# EAGLE design Zeus (EAGLE 9.6.2)
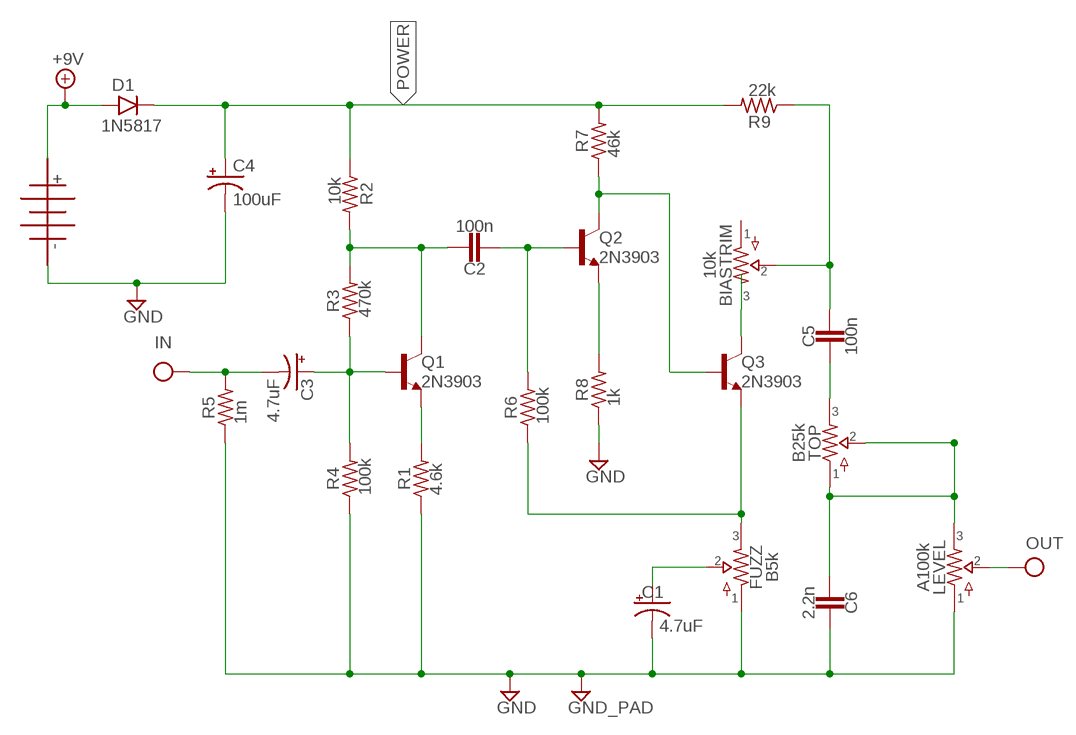
[diagram p0: schematic, sheet 1]

## Parts
9V  BATTERYBAT2  [BATTERY2]
BIASTRIM  10k  TRIMMER  [TRIM1]
C1  4.7uF  0501  [050_020_1]
C2  100n  CAP.2  [0.2".SML]
C3  4.7uF  0501  [050_020_1]
C4  100uF  0631  [063_025]
C5  100n  CAP.2  [0.2".SML]
C6  2.2n  CAP.2  [0.2".SML]
D1  1N5817  DO41.3  [DO41-3]
FUZZ  B5k  16MM.1  [16MM_B.MOUNT]
GND  GND_PAD  [SQUARE]
IN  IN  [SQUARE]
LEVEL  A100k  16MM.1  [16MM_B.MOUNT]
OUT  OUT  [SQUARE]
Q1  2N3903  2N5088  [TO92]
Q2  2N3903  2N5088  [TO92]
Q3  2N3903  2N5088  [TO92]
R1  4.6k  RESISTORS.3B  [R0207/3]
R2  10k  RESISTORS.3B  [R0207/3]
R3  470k  RESISTORS.3B  [R0207/3]
R4  100k  RESISTORS.3B  [R0207/3]
R5  1m  RESISTORS.3B  [R0207/3]
R6  100k  RESISTORS.3B  [R0207/3]
R7  46k  RESISTORS.3B  [R0207/3]
R8  1k  RESISTORS.3B  [R0207/3]
R9  22k  RESISTORS.3B  [R0207/3]
TOP  B25k  16MM.1  [16MM_B.MOUNT]

## Nets
+9V: 9V.P$1 D1.A
GND: 9V.P$2 C1.- C4.- C6.1 FUZZ.1 GND.1(GND) LEVEL.1 R1.1 R4.1 R5.1 R8.1
IN: C3.- IN.1(IN) R5.2
N$1: C2.1 Q1.1(C) R2.2 R3.2
N$2: C2.2 Q2.2(B) R6.2
N$3: C3.+ Q1.2(B) R3.1 R4.2
N$4: C5.2 TOP.3
N$5: Q1.3(E) R1.2
N$6: Q2.3(E) R8.2
N$7: FUZZ.3 Q3.3(E) R6.1
N$8: C1.+ FUZZ.2
N$10: BIASTRIM.3 Q3.1(C)
N$12: Q2.1(C) Q3.2(B) R7.1
N$13: BIASTRIM.2 C5.1 R9.1
N$14: C6.2 LEVEL.3 TOP.1 TOP.2
OUT: LEVEL.2 OUT.1(OUT)
POWER: C4.+ D1.C R2.1 R7.2 R9.2
Unconnected: BIASTRIM.1

## Library data of the parts
9V = jacks:BATTERY
BIASTRIM = potentiometers:TRIMMER: Trimpots
C1 C3 = caps-elec:050: 0.22 - 100uF Xicon values at Mouser.com: 10V: 10 - 100uF; 16V: 2.2 - 47uF; 25V: 0.47 - 47uF; 50V: 0.22 - 22uF
C2 C5 C6 = caps-film:CAP: For Ceramic, Film, MLCC caps
C4 = caps-elec:063: 33 - 220uF Xicon values at Mouser.com 10V: 220uF; 16V: 100uF; 25V: 100uF; 50V: 33uF
D1 = diodes:DO41: DO-41 Package Diodes: 1N4001 - 1N40019 Zener Diodes: 1N4728 - 1N4764
FUZZ LEVEL TOP = potentiometers:16MM: 16mm Poteniometers
GND = supply pins:GND_PAD: Ground use this to hook up ground connections throughout a schematic instead of running wire automatically labels the net "GND"
IN = supply pins:IN: Input obsolete: use Mark instead and label net schematic input label without circuit board terminal/pad labels net "IN" provided as complement to OUT (rarely used)
OUT = supply pins:OUT: Output obsolete: use Mark instead and label net output label without circuit board terminal/pad commonly used as output label on 2nd lug of a potentiometer
Q1-Q3 = transistors-BJT:2N5088: NPN - 2n5088, 2n5089, 2n3904, MPSA18 [C]-B-E pinout 2n5088: http://smallbear-electronics.mybigcommerce.com/transistor-2n5088/ 2n5089: http://smallbear-electronics.mybigcommerce.com/transistor-2n5089/ 2n5089: http://smallbear-electronics.mybigcommerce.com/transistor-2n5089-motorola/ 2n3904: http://smallbear-electronics.mybigcommerce.com/transistor-2n3904/ MPSA18: http://smallbear-electronics.mybigcommerce.com/transistor-mpsa18/
R1-R9 = resistors:RESISTORS

## Board
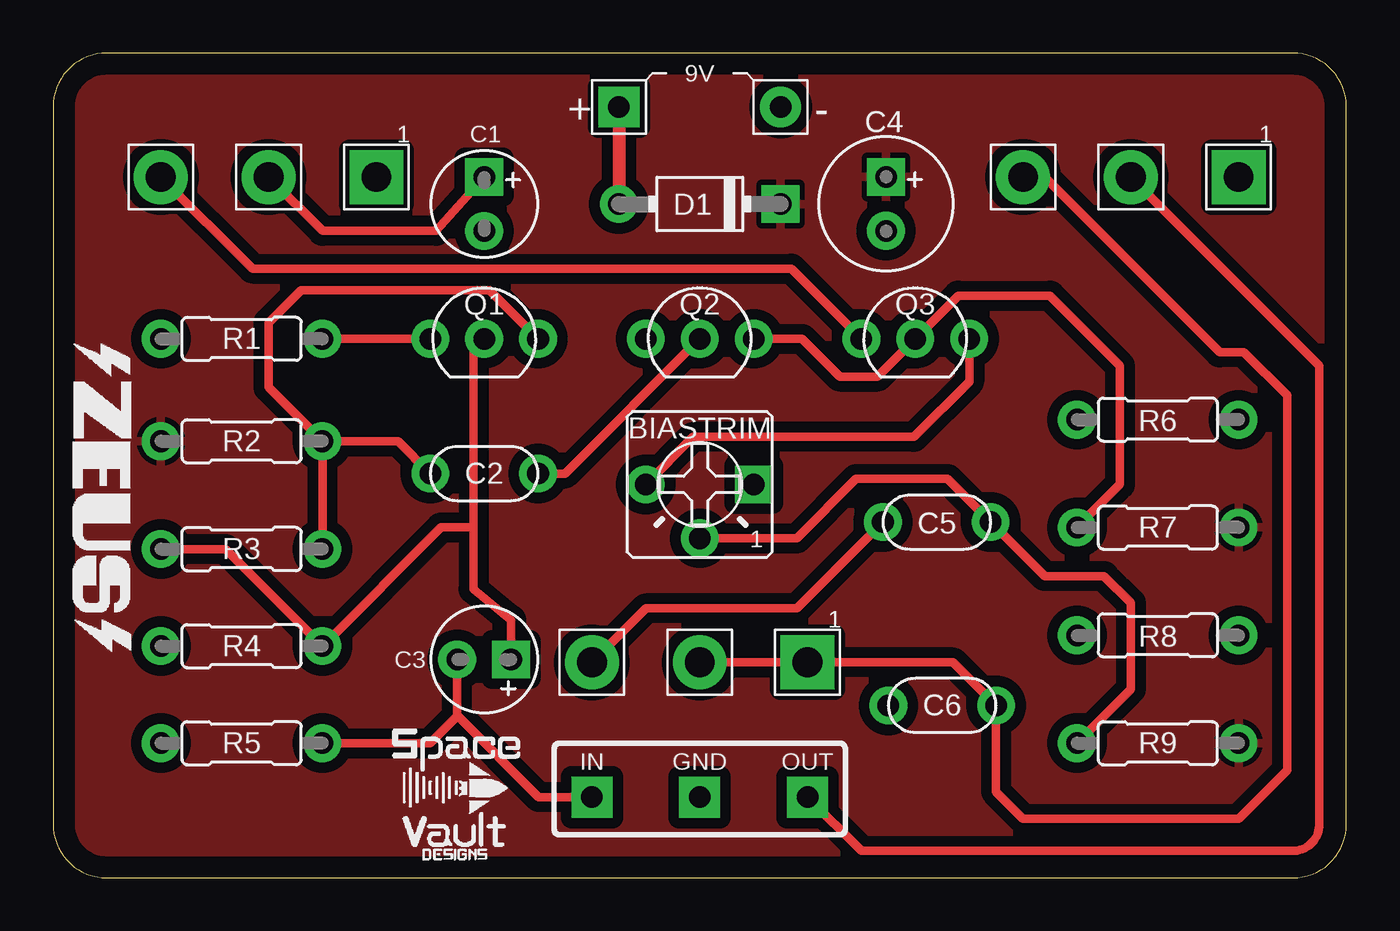
[diagram p1: board, top side]
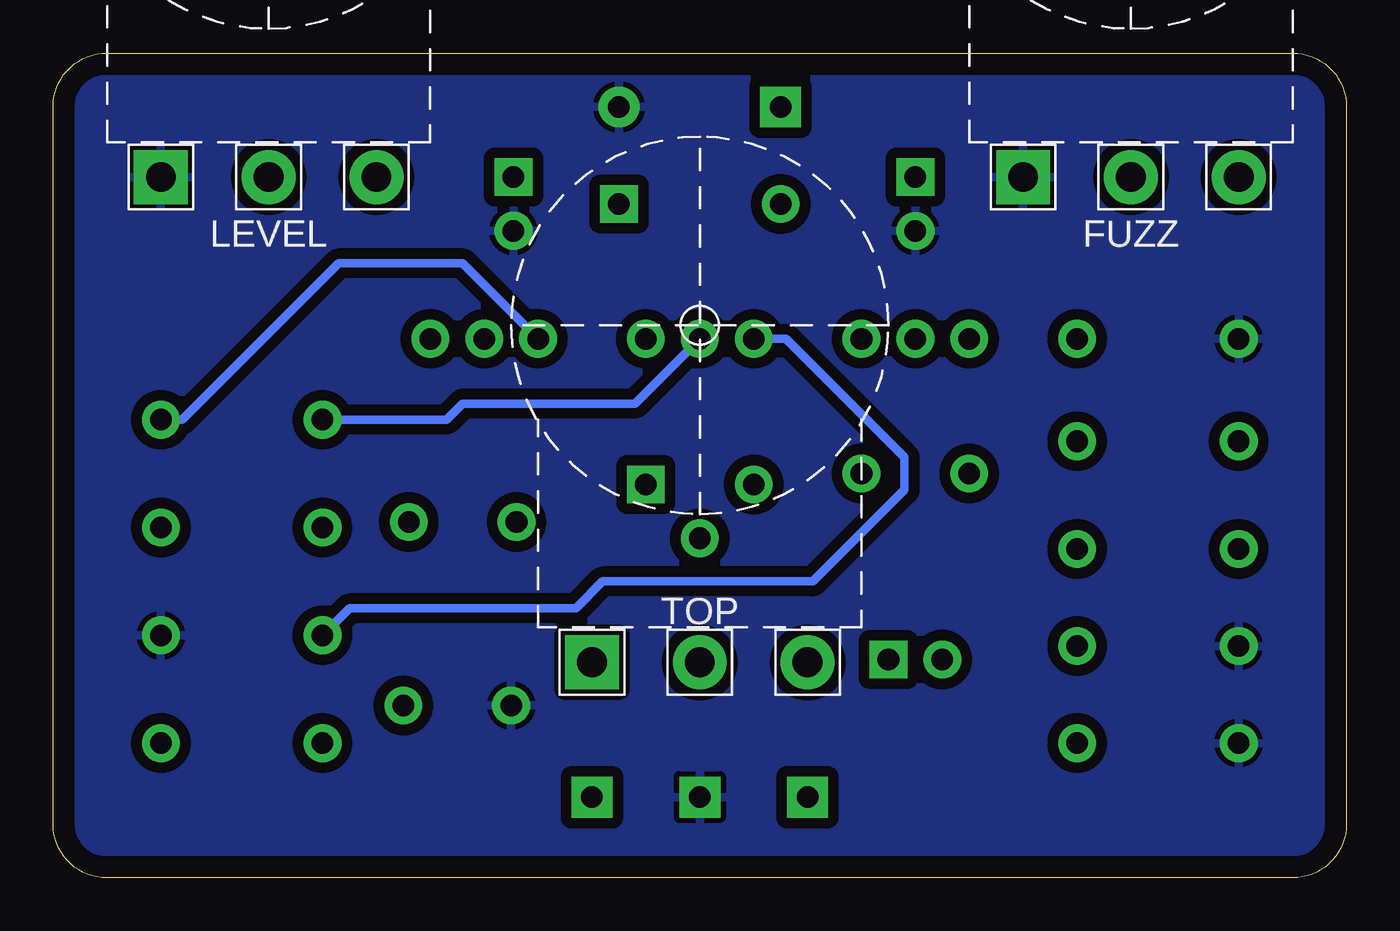
[diagram p2: board, bottom side, seen from below]

Size 60.96 x 38.86 mm. Coordinates in mm from the lower left corner, seen from the top.
Outline: 0,2.54 arc90 2.54,0 58.42,0 arc90 60.96,2.54 60.96,36.32 arc90 58.42,38.86 2.54,38.86 arc90 0,36.32 0,2.54
Copper layers (1*16): Top 0.035mm / dielectric 1.5mm / Bottom 0.035mm
Design rules "default": minimum track width 6mil, minimum drill 0.35mm, track to track 6mil, track to pad 6mil, pad to pad 6mil, via to via 6mil, smd to smd 6mil, copper to edge 40mil, drill to drill 6mil, minimum pad ring 10mil, minimum via ring 8mil, stop-mask expansion 4mil, vias tented up to drill 0mil, thermal gap 10mil

### Footprints (pad centres in the part's own frame; a part is rotated, then mirrored left to right if it is on the bottom)
BATTERY2 = drill 1.016 pad 1.93 square: P$1 -3.81,0 | drill 1.016 pad 1.93: P$2 3.81,0
TRIM1 = drill 1.016 pad 1.778 square: 1 -2.54,0 | drill 1.016 pad 1.778: 2 0,2.54; 3 2.54,0
050_020_1 = drill 1.016 pad 1.778 square: + -1.27,0 | drill 1.016 pad 1.778: - 1.27,0
0.2".SML = drill 1.016 pad 1.778: 1 -2.54,0; 2 2.54,0
063_025 = drill 1.016 pad 1.778 square: + -1.27,0 | drill 1.016 pad 1.778: - 1.27,0
DO41-3 = drill 1.016 pad 1.778: A 3.81,0 | drill 1.016 pad 1.778 square: C -3.81,0
16MM_B.MOUNT = drill 1.4 pad 2.54 square: 1 5.08,0 | drill 1.4 pad 2.54: 2 0,0; 3 -5.08,0
SQUARE = drill 1.016 pad 1.93 square: 1 0,0
TO92 = drill 1.016 pad 1.778: 1 -2.54,0; 2 0,0; 3 2.54,0
R0207/3 = drill 1.016 pad 1.778: 1 -3.81,0; 2 3.81,0

### Placement (x,y rotation side)
9V  30.48,36.32 0 top
BIASTRIM  30.48,18.54 180 top
C1  20.32,31.75 270 top
C2  20.32,19.05 0 top
C3  20.32,10.29 180 top
C4  39.26,31.76 270 top
C5  41.65,16.76 180 top
C6  41.91,8.13 0 top
D1  30.48,31.75 180 top
FUZZ  10.16,33.02 0 top
GND  30.48,3.81 0 top
IN  25.4,3.81 0 top
LEVEL  50.8,33.02 0 top
OUT  35.56,3.81 0 top
Q1  20.32,25.4 180 top
Q2  30.48,25.4 180 top
Q3  40.64,25.4 180 top
R1  8.89,25.4 0 top
R2  8.89,20.57 0 top
R3  8.89,15.49 0 top
R4  8.89,10.92 0 top
R5  8.89,6.35 0 top
R6  52.07,21.59 180 top
R7  52.07,16.51 0 top
R8  52.07,11.43 180 top
R9  52.07,6.35 0 top
TOP  30.48,10.16 0 top

### Tracks (layer width: path | path; a pad name or v marks a point on that pad's centre or on a via)
+9V
  Top 0.61: 9V.P$1 D1.A
GND
  pour Bottom (isolate 0.508): 0,2.54 0,36.32 arc-90 2.54,38.86 58.42,38.86 arc-90 60.96,36.32 60.96,2.54 arc-90 58.42,0 2.54,0 arc-90
IN
  Top 0.406: IN.1 22.89,3.81 19.07,7.63 | 19.07,7.63 19.05,7.65 C3.- | R5.2 17.78,6.35 19.07,7.63
N$1
  Top 0.406: R2.2 16.25,20.57 C2.1 | R3.2 R2.2 | R2.2 10.16,23.11 10.16,26.16 11.68,27.68 20.57,27.68 Q1.1
N$2
  Top 0.406: C2.2 24.13,19.05 Q2.2
  Bottom 0.406: R6.2 42.42,21.59 41.66,22.35 33.53,22.35 Q2.2
N$3
  Top 0.406: Q1.2 19.81,24.89 19.81,16.51 | 19.81,16.51 19.81,13.61 21.59,12.15 C3.+ | R3.1 8.13,15.49 R4.2 18.29,16.51 19.81,16.51
N$4
  Top 0.406: C5.2 35.05,12.7 27.94,12.7 TOP.3
N$5
  Top 0.406: R1.2 Q1.3
N$6
  Bottom 0.406: Q2.3 26.41,25.4 20.83,19.81 20.83,18.29 25.14,13.97 35.05,13.97 36.32,12.7 46.99,12.7 R8.2
N$7
  Top 0.406: FUZZ.3 9.4,28.7 34.8,28.7 Q3.3
  Bottom 0.406: Q3.3 41.66,28.95 47.5,28.95 54.86,21.59 R6.1
N$8
  Top 0.406: C1.+ 18.05,30.48 12.7,30.48 FUZZ.2
N$10
  Top 0.406: BIASTRIM.3 30.17,20.78 40.57,20.78 43.18,23.39 Q3.1
N$12
  Top 0.406: Q2.1 35.3,25.4 37.08,23.62 38.86,23.62 Q3.2 42.67,27.43 46.99,27.43 50.29,24.13 50.29,18.54 R7.1
N$13
  Top 0.406: R9.1 50.8,8.89 50.8,12.95 49.53,14.22 46.73,14.22 C5.1 42.16,18.8 37.84,18.8 35.05,16 BIASTRIM.2
N$14
  Top 0.406: TOP.2 TOP.1 42.42,10.16 C6.2 44.45,4.06 45.72,2.79 55.88,2.79 58.16,5.08 58.16,22.73 56.13,24.76 54.99,24.76 46.73,33.02 LEVEL.3
OUT
  Top 0.406: OUT.1 38.1,1.27 58.42,1.27 arc90 59.69,2.54 59.69,24.13 LEVEL.2
POWER
  pour Top (isolate 0.508): 0,2.54 0,36.32 arc-90 2.54,38.86 58.42,38.86 arc-90 60.96,36.32 60.96,2.54 arc-90 58.42,0 2.54,0 arc-90